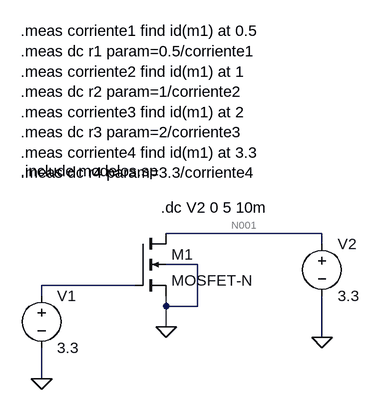
[diagram p0: schematic sim1 ID nmos.asc]
sim1 ID nmos.asc, the LTspice schematic file:
Version 4
SHEET 1 880 680
WIRE 368 192 128 192
WIRE 368 208 368 192
WIRE 176 240 128 240
WIRE 80 272 -64 272
WIRE -64 288 -64 272
WIRE 128 304 128 288
WIRE 176 304 176 240
WIRE 176 304 128 304
WIRE 128 336 128 304
WIRE 368 352 368 288
WIRE -64 416 -64 368
FLAG -64 416 0
FLAG 368 352 0
FLAG 128 336 0
SYMBOL nmos4 80 192 R0
SYMATTR InstName M1
SYMATTR Value MOSFET-N
SYMATTR Value2 l=0.6u w=10.8u
SYMBOL voltage -64 272 R0
WINDOW 123 0 0 Left 0
WINDOW 39 0 0 Left 0
SYMATTR InstName V1
SYMATTR Value 3.3
SYMBOL voltage 368 192 R0
WINDOW 123 0 0 Left 0
WINDOW 39 0 0 Left 0
SYMATTR InstName V2
SYMATTR Value 3.3
TEXT 120 152 Left 2 !.dc V2 0 5 10m
TEXT -96 96 Left 2 !.include modelos.sp
TEXT -96 -120 Left 2 !.meas corriente1 find id(m1) at 0.5\n.meas dc r1 param=0.5/corriente1\n.meas corriente2 find id(m1) at 1\n.meas dc r2 param=1/corriente2\n.meas corriente3 find id(m1) at 2\n.meas dc r3 param=2/corriente3\n.meas corriente4 find id(m1) at 3.3\n.meas dc r4 param=3.3/corriente4

The netlist it stands for:
* sim1 ID nmos.asc
M1 N001 N002 0 0 MOSFET-N l=0.6u w=10.8u
V1 N002 0 3.3
V2 N001 0 3.3
.model NMOS NMOS
.model PMOS PMOS
.lib standard.mos
.dc V2 0 5 10m
.include modelos.sp
.meas corriente1 find id(m1) at 0.5
.meas dc r1 param=0.5/corriente1
.meas corriente2 find id(m1) at 1
.meas dc r2 param=1/corriente2
.meas corriente3 find id(m1) at 2
.meas dc r3 param=2/corriente3
.meas corriente4 find id(m1) at 3.3
.meas dc r4 param=3.3/corriente4
.backanno
.end

* Results of the author's LTspice run, read from the files saved beside the schematic
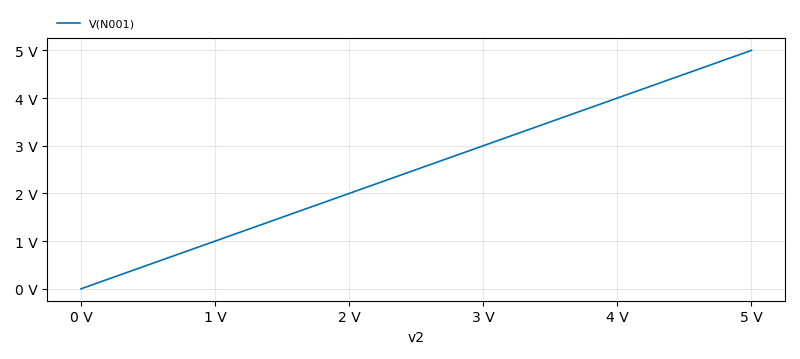
[diagram p1: DC transfer characteristic of sim1 ID nmos.asc, plotted from the saved traces]
* DC transfer characteristic, 1 run:
*   V(N001): 0 V at v2=0 V, 5 V at v2=5 V, min 0 V, max 5 V
* From the log:
*   corriente1: id(m1)=0.00150897 at 0.5
*   r1: 0.5/corriente1=331.352
*   corriente2: id(m1)=0.002555 at 1
*   r2: 1/corriente2=391.39
*   corriente3: id(m1)=0.00296624 at 2
*   r3: 2/corriente3=674.254
*   corriente4: id(m1)=0.00305959 at 3.3
*   r4: 3.3/corriente4=1078.58